# Altium project DAP.PrjPcb (part 3 of 3)

## Sheet DAP-MCU-3.SchDoc
size D; SheetNumber: 3; SheetTotal: 4
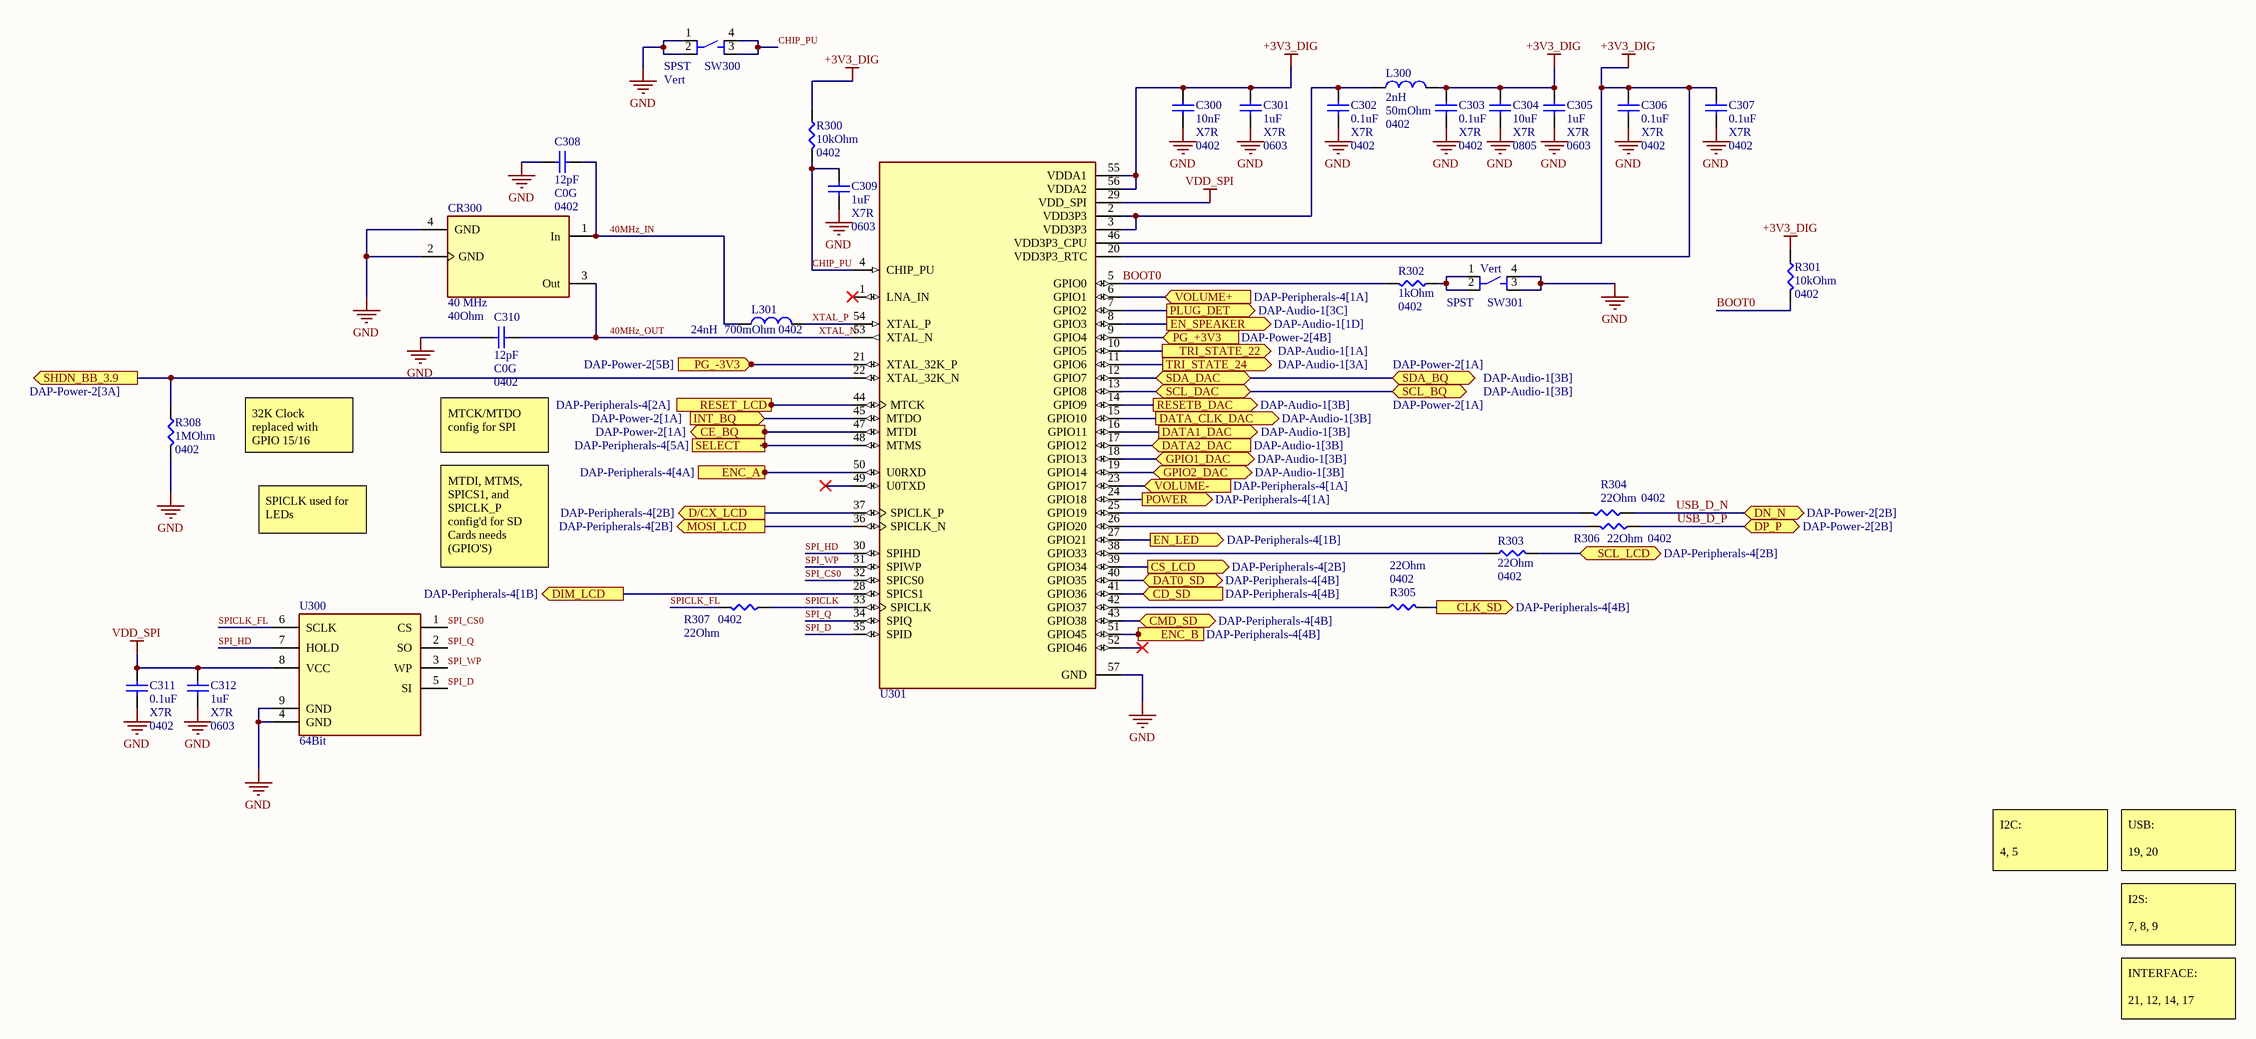
[diagram p2: DAP-MCU-3.SchDoc]

### Parts
C300  <Value>: 10nF  <Spec>: X7R  <Footprint>: 0402  [CAPC1005X55N]  (hidden comment: CAP CER 10000PF 16V X7R 0402)
C301  <Value>: 1uF  <Spec>: X7R  <Footprint>: 0603  [CAPC1608X100N]  (hidden comment: CAP CER 1UF 25V X7R 0603)
C302  <Value>: 0.1uF  <Spec>: X7R  <Footprint>: 0402  [CAPC1005X60N]  (hidden comment: CAP CER 0.1UF 50V X7R 0402)
C303  <Value>: 0.1uF  <Spec>: X7R  <Footprint>: 0402  [CAPC1005X60N]  (hidden comment: CAP CER 0.1UF 50V X7R 0402)
C304  <Value>: 10uF  <Spec>: X7R  <Footprint>: 0805  [CAPC2012X140N]  (hidden comment: CAP CER 10UF 10V X7R 0805)
C305  <Value>: 1uF  <Spec>: X7R  <Footprint>: 0603  [CAPC1608X100N]  (hidden comment: CAP CER 1UF 25V X7R 0603)
C306  <Value>: 0.1uF  <Spec>: X7R  <Footprint>: 0402  [CAPC1005X60N]  (hidden comment: CAP CER 0.1UF 50V X7R 0402)
C307  <Value>: 0.1uF  <Spec>: X7R  <Footprint>: 0402  [CAPC1005X60N]  (hidden comment: CAP CER 0.1UF 50V X7R 0402)
C308  <Value>: 12pF  <Spec>: C0G  <Footprint>: 0402  [CAPC1005X60N]  (hidden comment: CAP CER 12PF 50V C0G/NP0 0402)
C309  <Value>: 1uF  <Spec>: X7R  <Footprint>: 0603  [CAPC1608X100N]  (hidden comment: CAP CER 1UF 25V X7R 0603)
C310  <Value>: 12pF  <Spec>: C0G  <Footprint>: 0402  [CAPC1005X60N]  (hidden comment: CAP CER 12PF 50V C0G/NP0 0402)
C311  <Value>: 0.1uF  <Spec>: X7R  <Footprint>: 0402  [CAPC1005X60N]  (hidden comment: CAP CER 0.1UF 50V X7R 0402)
C312  <Value>: 1uF  <Spec>: X7R  <Footprint>: 0603  [CAPC1608X100N]  (hidden comment: CAP CER 1UF 25V X7R 0603)
CR300  <Value>: 40 MHz  <Spec>: 40Ohm  [CRYST_ECS-400]  (hidden comment: CRYSTAL 40.0000MHZ 10PF SMD)
L300  <Value>: 2nH  <Spec>: 50mOhm  <Footprint>: 0402  [IND_MHQ100507]  (hidden comment: FIXED IND 2NH 1A 50 MOHM SMD)
L301  <Value>: 24nH  <Spec>: 700mOhm  <Footprint>: 0402  [IND_MHQ100507]  (hidden comment: FIXED IND 24NH 250MA 700 MOHM)
R300  <Value>: 10kOhm  <Footprint>: 0402  [RESC1005X40N]  (hidden comment: RES SMD 10K OHM 1% 1/16W 0402)
R301  <Value>: 10kOhm  <Footprint>: 0402  [RESC1005X40N]  (hidden comment: RES SMD 10K OHM 1% 1/16W 0402)
R302  <Value>: 1kOhm  <Footprint>: 0402  [RESC1005X40N]  (hidden comment: RES SMD 1K OHM 0.1% 1/16W 0402)
R303  <Value>: 22Ohm  <Footprint>: 0402  [RESC1005X40N]  (hidden comment: RES 22 OHM 1% 1/16W 0402)
R304  <Value>: 22Ohm  <Footprint>: 0402  [RESC1005X40N]  (hidden comment: RES 22 OHM 1% 1/16W 0402)
R305  <Value>: 22Ohm  <Footprint>: 0402  [RESC1005X40N]  (hidden comment: RES 22 OHM 1% 1/16W 0402)
R306  <Value>: 22Ohm  <Footprint>: 0402  [RESC1005X40N]  (hidden comment: RES 22 OHM 1% 1/16W 0402)
R307  <Value>: 22Ohm  <Footprint>: 0402  [RESC1005X40N]  (hidden comment: RES 22 OHM 1% 1/16W 0402)
R308  <Value>: 1MOhm  <Footprint>: 0402  [RESC1005X40N]  (hidden comment: RES SMD 1M OHM 0.1% 1/16W 0402)
SW300  <Value>: SPST  <Footprint>: Vert  [SW_PTS810_SJM_250_SMTR_LFS]  (hidden comment: SWITCH TACTILE SPST-NO 0.05A 16V)
SW301  <Value>: SPST  <Footprint>: Vert  [SW_PTS810_SJM_250_SMTR_LFS]  (hidden comment: SWITCH TACTILE SPST-NO 0.05A 16V)
U300  <Value>: 64Bit  [SON127P600X500X80-9N]  (hidden comment: IC FLASH 64MBIT SPI/QUAD 8WSON)
U301  ESP32-S3  [IC_ESP32-S3]  (value not drawn)

### Ports
CD_SD (in, see DAP-Peripherals-4[4B]), CE_BQ (out, see DAP-Power-2[1A]), CLK_SD (out, see DAP-Peripherals-4[4B]), CMD_SD (bidir, see DAP-Peripherals-4[4B]), CS_LCD (out, see DAP-Peripherals-4[2B]), D/CX_LCD (out, see DAP-Peripherals-4[2B]), DAT0_SD (bidir, see DAP-Peripherals-4[4B]), DATA1_DAC (out, see DAP-Audio-1[3B]), DATA2_DAC (in, see DAP-Audio-1[3B]), DATA_CLK_DAC (out, see DAP-Audio-1[3B]), DIM_LCD (out, see DAP-Peripherals-4[1B]), DN_N (bidir, see DAP-Power-2[2B]), DP_P (bidir, see DAP-Power-2[2B]), EN_LED (out, see DAP-Peripherals-4[1B]), EN_SPEAKER (out, see DAP-Audio-1[1D]), ENC_A (in, see DAP-Peripherals-4[4A]), ENC_B (in, see DAP-Peripherals-4[4B]), GPIO1_DAC (bidir, see DAP-Audio-1[3B]), GPIO2_DAC (bidir, see DAP-Audio-1[3B]), INT_BQ (in, see DAP-Power-2[1A]), MOSI_LCD (out, see DAP-Peripherals-4[2B]), PG_+3V3 (in, see DAP-Power-2[4B]), PG_-3V3 (in, see DAP-Power-2[5B]), PLUG_DET (out, see DAP-Audio-1[3C]), POWER (out, see DAP-Peripherals-4[1A]), RESET_LCD (out, see DAP-Peripherals-4[2A]), RESETB_DAC (out, see DAP-Audio-1[3B]), SCL_BQ (bidir, see DAP-Power-2[1A]), SCL_DAC (bidir, see DAP-Audio-1[3B]), SCL_LCD (bidir, see DAP-Peripherals-4[2B]), SDA_BQ (bidir, see DAP-Power-2[1A]), SDA_DAC (bidir, see DAP-Audio-1[3B]), SELECT (in, see DAP-Peripherals-4[5A]), SHDN_BB_3.9 (out, see DAP-Power-2[3A]), TRI_STATE_22 (out, see DAP-Audio-1[1A]), TRI_STATE_24 (out, see DAP-Audio-1[3A]), VOLUME+ (in, see DAP-Peripherals-4[1A]), VOLUME- (in, see DAP-Peripherals-4[1A])

### Nets
+3V3_DIG: C300.2 C301.2 C303.2 C304.2 C305.2 C306.2 C307.2 L300.2 R300.2 R301.2 U301.20(VDD3P3_RTC) U301.46(VDD3P3_CPU) U301.55(VDDA1) U301.56(VDDA2)
GND: C300.1 C301.1 C302.1 C303.1 C304.1 C305.1 C306.1 C307.1 C308.2 C309.1 C310.2 C311.1 C312.1 CR300.2(GND) CR300.4(GND) R308.1 SW300.1 SW300.2 SW301.3 SW301.4 U300.4(GND) U300.9(GND) U301.57(GND)
VDD_SPI: C311.2 C312.2 U300.8(VCC) U301.29(VDD_SPI)
40MHz_IN: C308.1 CR300.1(In) L301.1
40MHz_OUT: C310.1 CR300.3(Out) U301.53(XTAL_N)  [also labelled XTAL_N]
BOOT0: R301.1 R302.1 U301.5(GPIO0)
CD_SD: U301.41(GPIO36) ; port CD_SD
CE_BQ: U301.47(MTDI) ; port CE_BQ
CHIP_PU: C309.2 R300.1 SW300.3 SW300.4 U301.4(CHIP_PU)
CLK_SD: R305.1 ; port CLK_SD
CMD_SD: U301.43(GPIO38) ; port CMD_SD
CS_LCD: U301.39(GPIO34) ; port CS_LCD
D/CX_LCD: U301.37(SPICLK_P) ; port D/CX_LCD
DAT0_SD: U301.40(GPIO35) ; port DAT0_SD
DATA1_DAC: U301.16(GPIO11) ; port DATA1_DAC
DATA2_DAC: U301.17(GPIO12) ; port DATA2_DAC
DATA_CLK_DAC: U301.15(GPIO10) ; port DATA_CLK_DAC
GPIO1_DAC: U301.18(GPIO13) ; port GPIO1_DAC
GPIO2_DAC: U301.19(GPIO14) ; port GPIO2_DAC
INT_BQ: U301.45(MTDO) ; port INT_BQ
MOSI_LCD: U301.36(SPICLK_N) ; port MOSI_LCD
PG_LDO-: U301.21(XTAL_32K_P) ; port PG_-3V3
POWER: U301.24(GPIO18) ; port POWER
RESET: U301.44(MTCK) ; port RESET_LCD
RESETB_DAC: U301.14(GPIO9) ; port RESETB_DAC
SCL_BQ: U301.13(GPIO8) ; port SCL_DAC, port SCL_BQ
SCL_LCD: R303.1 ; port SCL_LCD
SDA_BQ: U301.12(GPIO7) ; port SDA_DAC, port SDA_BQ
SELECT: U301.48(MTMS) ; port SELECT
SPI_CS0: U300.1(CS) U301.32(SPICS0)
SPI_D: U300.5(SI) U301.35(SPID)
SPI_HD: U300.7(HOLD) U301.30(SPIHD)
SPI_Q: U300.2(SO) U301.34(SPIQ)
SPI_WP: U300.3(WP) U301.31(SPIWP)
SPICLK: R307.2 U301.33(SPICLK)
SPICLK_FL: R307.1 U300.6(SCLK)
TRI_STATE_22: U301.10(GPIO5) ; port TRI_STATE_22
TRI_STATE_24: U301.11(GPIO6) ; port TRI_STATE_24
USB_D_N: R304.2 ; port DN_N
USB_D_P: R306.2 ; port DP_P
VOLUME+: U301.6(GPIO1) ; port VOLUME+
VOLUME-: U301.23(GPIO17) ; port VOLUME-
XTAL_P: L301.2 U301.54(XTAL_P)
NetC302_2: C302.2 L300.1 U301.2(VDD3P3) U301.3(VDD3P3)
NetC404_2: U301.50(U0RXD) ; port ENC_A
NetC405_2: U301.51(GPIO45) ; port ENC_B
NetQ400_1: U301.28(SPICS1) ; port DIM_LCD
NetR119_1: U301.7(GPIO2) ; port PLUG_DET
NetR128_1: U301.8(GPIO3) ; port EN_SPEAKER
NetR203_1: R308.2 U301.22(XTAL_32K_N) ; port SHDN_BB_3.9
NetR223_1: U301.9(GPIO4) ; port PG_+3V3
NetR302_2: R302.2 SW301.1 SW301.2
NetR303_2: R303.2 U301.38(GPIO33)
NetR304_1: R304.1 U301.25(GPIO19)
NetR305_2: R305.2 U301.42(GPIO37)
NetR306_1: R306.1 U301.26(GPIO20)
NetU301_27: U301.27(GPIO21) ; port EN_LED

Not connected (* = marked no-connect by the designer): U301 1(LNA_IN)* 49(U0TXD)* 52(GPIO46)*

### Notes on the sheet
- 32K Clock replaced with GPIO 15/16
- MTCK/MTDO config for SPI
- SPICLK used for LEDs
- MTDI, MTMS, SPICS1, and SPICLK_P config'd for SD Cards needs (GPIO'S)
- I2C:
  4, 5
- USB:
  19, 20
- I2S:
  7, 8, 9
- INTERFACE:
  21, 12, 14, 17

### Library data of the parts
C300 = #1-040: Manufacturer 1: YAGEO; Manufacturer Part Number 1: CC0402KRX7R7BB103; AL-PN: #1-040; SubType: Ceramic; <Tolerance>: 0.1; <Termination>: SMD; Creator Project: aRTy; Type: Standard; Lead Time: 21 Weeks; PartType: Capacitor; <Rating>: 16V; Status: Verified; Supplier 1: Digikey; Supplier Label: 10000 pF ±10% 16V Ceramic Capacitor X7R 0402 (1005 Metric); Supplier Part Number 1: 311-1042-2-ND
C301 C305 C309 C312 = #1-132: Manufacturer 1: Murata Electronics; Manufacturer Part Number 1: GCM188R71E105KA64D; AL-PN: #1-132; SubType: Ceramic; <Tolerance>: 0.1; <Termination>: SMD; Creator Project: DAP; Type: Standard; Lead Time: 21 Weeks; PartType: Capacitor; <Rating>: 25V; Status: Verified; Supplier 1: Digikey; Supplier Label: 1 µF ±10% 25V Ceramic Capacitor X7R 0603 (1608 Metric); Supplier Part Number 1: 490-10673-1-ND
C302 C303 C306 C307 C311 = #1-080: Manufacturer 1: Murata Electronics; Manufacturer Part Number 1: GCM155R71H104KE02D; AL-PN: #1-080; SubType: Ceramic; <Tolerance>: 0.1; <Termination>: SMD; Creator Project: DAP; Type: Standard; Lead Time: 21 Weeks; PartType: Capacitor; <Rating>: 50V; Status: Verified; Supplier 1: Digikey; Supplier Label: 0.1 µF ±10% 50V Ceramic Capacitor X7R 0402 (1005 Metric); Supplier Part Number 1: 490-10672-1-ND
C304 = #1-081: Manufacturer 1: Murata Electronics; Manufacturer Part Number 1: GCM21BR71A106KE22K; AL-PN: #1-081; SubType: Ceramic; <Tolerance>: 0.1; <Termination>: SMD; Creator Project: DAP; Type: Standard; Lead Time: 21 Weeks; PartType: Capacitor; <Rating>: 10V; Status: Verified; Supplier 1: Digikey; Supplier Label: 10 µF ±10% 10V Ceramic Capacitor X7R 0805 (2012 Metric); Supplier Part Number 1: 490-14531-1-ND
C308 C310 = #1-122: Manufacturer 1: Murata Electronics; Manufacturer Part Number 1: GJM1555C1H120FB01D; AL-PN: #1-122; SubType: Ceramic; <Tolerance>: 0.01; <Termination>: SMD; Creator Project: DAP; Type: Standard; Lead Time: 17 Weeks; PartType: Capacitor; <Rating>: 50V; Status: Verified; Supplier 1: Digikey; Supplier Label: 12 pF ±1% 50V Ceramic Capacitor C0G, NP0 0402 (1005 Metric); Supplier Part Number 1: 490-11190-1-ND
CR300 = #1-118: Manufacturer 1: ECS Inc.; Manufacturer Part Number 1: ECS-400-10-37B2-CKY-TR; AL-PN: #1-118; Creator Project: DAP; Type: Standard; PartType: Crystal; <Rating>: 10pF; <Termination>: SMD; Status: Verified; Supplier 1: Digikey; Supplier Label: 40 MHz ±10ppm Crystal 12pF 40 Ohms 4-SMD, No Lead; Supplier Part Number 1: 50-ECS-400-10-37B2-CKY-TRCT-ND; Lead Time: N/A
L300 = #1-121: Manufacturer 1: TDK; Manufacturer Part Number 1: MHQ1005075HA2N0BTD25; AL-PN: #1-121; SubType: Shielded; Creator Project: DAP; Type: Standard; Lead Time: 12 Weeks; PartType: Inductor; <Rating>: 1A; <Termination>: SMD; Status: Verified; Supplier 1: Digikey; Supplier Label: 2 nH Shielded Multilayer Inductor 1 A 50mOhm Max 0402 (1005 Metric); Supplier Part Number 1: 445-MHQ1005075HA2N0BTD25CT-ND
L301 = #1-120: Manufacturer 1: TDK; Manufacturer Part Number 1: MHQ1005075HA24NHTD25; AL-PN: #1-120; SubType: Shielded; <Tolerance>: 0.03; <Termination>: SMD; Creator Project: DAP; Type: Standard; Lead Time: 12 Weeks; PartType: Inductor; <Rating>: 250mA; Status: Verified; Supplier 1: Digikey; Supplier Label: 24 nH Shielded Multilayer Inductor 250 mA 700mOhm Max 0402 (1005 Metric); Supplier Part Number 1: 445-MHQ1005075HA24NHTD25CT-ND
R300 R301 = #1-134: Manufacturer 1: YAGEO; Manufacturer Part Number 1: AC0402FR-0710KL; AL-PN: #1-134; <Tolerance>: 0.01; Creator Project: DAP; Lead Time: 22 Weeks; PartType: Resistor; <Termination>: SMD; Status: Verified; Supplier 1: Digikey; Supplier Label: 10 kOhms ±1% 0.063W, 1/16W Chip Resistor 0402 (1005 Metric) Automotive AEC-Q200, Moisture Resistant Thick Film; Supplier Part Number 1: YAG3436CT-ND; Type: Standard
R302 = #1-043: Manufacturer 1: YAGEO; Manufacturer Part Number 1: RT0402BRD071KL; AL-PN: #1-043; <Tolerance>: 0.001; Creator Project: aRTy; Lead Time: 20 Weeks; PartType: Resistor; <Rating>: 1/16W; <Termination>: SMD; Status: Verified; Supplier 1: Digikey; Supplier Label: 1 kOhms ±0.1% 0.063W, 1/16W Chip Resistor 0402 (1005 Metric) Thin Film; Supplier Part Number 1: YAG1386TR-ND; Type: Standard
R303-R307 = #1-102: Manufacturer 1: YAGEO; Manufacturer Part Number 1: RC0402FR-0722RL; AL-PN: #1-102; <Tolerance>: 0.01; <Termination>: SMD; Creator Project: DAP; Lead Time: 22 Weeks; PartType: Resistor; <Rating>: 1/16W; Status: Verified; Supplier 1: Digikey; Supplier Label: 22 Ohms ±1% 0.063W, 1/16W Chip Resistor 0402 (1005 Metric) Moisture Resistant Thick Film; Supplier Part Number 1: 311-22.0LRCT-ND; Type: Standard
R308 = #1-123: Manufacturer 1: YAGEO; Manufacturer Part Number 1: RE0402BRE071ML; AL-PN: #1-123; <Tolerance>: 0.001; Creator Project: DAP; Lead Time: 20 Weeks; PartType: Resistor; <Rating>: 1/16W; <Termination>: SMD; Status: Verified; Supplier 1: Digikey; Supplier Label: 1 MOhms ±0.1% 0.063W, 1/16W Chip Resistor 0402 (1005 Metric) Thick Film; Supplier Part Number 1: 13-RE0402BRE071MLCT-ND; Type: Standard
SW300 SW301 = #1-115: Manufacturer Part Number 1: PTS810SJM250SMTR LFS; MF: C&K; MP: PTS810 SJM 250 SMTR LFS; AL-PN: #1-115; SubType: Tacticle; <Termination>: SMD; Creator Project: DAP; Lead Time: 16 Weeks; SnapEDA_Link: https://www.snapeda.com/parts/PTS810%20SJM%20250%20SMTR%20LFS/C%2526K/view-part/?ref=snap; Package: None; Value: *; Check_prices: https://www.snapeda.com/parts/PTS810%20SJM%20250%20SMTR%20LFS/C%2526K/view-part/?ref=eda; PartType: Switch; Status: Verified; Supplier 1: Digikey; Supplier Label: Tactile Switch SPST-NO Top Actuated Surface Mount; Supplier Part Number 1: CKN10502CT-ND; Type: Standard; Manufacturer 1: C&K
U300 = #1-124: Manufacturer 1: Gigadevice Electronics Singapore PTE.LTD.; Manufacturer Part Number 1: GD25B64EWIGR; AL-PN: #1-124; <Rating>: 133MHz; <Termination>: SMD; Creator Project: DAP; PartType: IC; SubType: FLASH; Status: Verified; Supplier 1: Digikey; Supplier Label: FLASH - NOR (SLC) Memory IC 64Mbit SPI - Quad I/O 133 MHz 7 ns 8-WSON (5x6); Supplier Part Number 1: 1970-GD25B64EWIGRCT-ND; Type: Standard; Lead Time: N/A
U301 = #1-055: Manufacturer 1: Espressif Technologies; MF: Espressif Systems; AL-PN: #1-055; SubType: ESP-32; <Termination>: SMD; Creator Project: DAP; Lead Time: 8 Weeks; Check_prices: https://www.snapeda.com/parts/ESP32-S3/Espressif+Systems/view-part/?ref=eda; Purchase-URL: https://pricing.snapeda.com/search/part/ESP32-S3/?ref=eda; Value: *; Availability: In Stock; Package: None; SnapEDA_Link: https://www.snapeda.com/parts/ESP32-S3/Espressif+Systems/view-part/?ref=snap; MP: ESP32-S3; Price: None; PartType: MCU; Status: Verified; Supplier 1: Digikey; Supplier Label: IC RF TxRx + MCU Bluetooth, WiFi 802.11b/g/n, Bluetooth v5.0 2.412GHz ~ 2.484GHz 56-VFQFN Exposed Pad; Supplier Part Number 1: 1965-ESP32-S3-ND; Type: Standard; Manufacturer Part Number 1: ESP32-S3

## Sheet DAP-Peripherals-4.SchDoc
size C; SheetNumber: 4; SheetTotal: 4
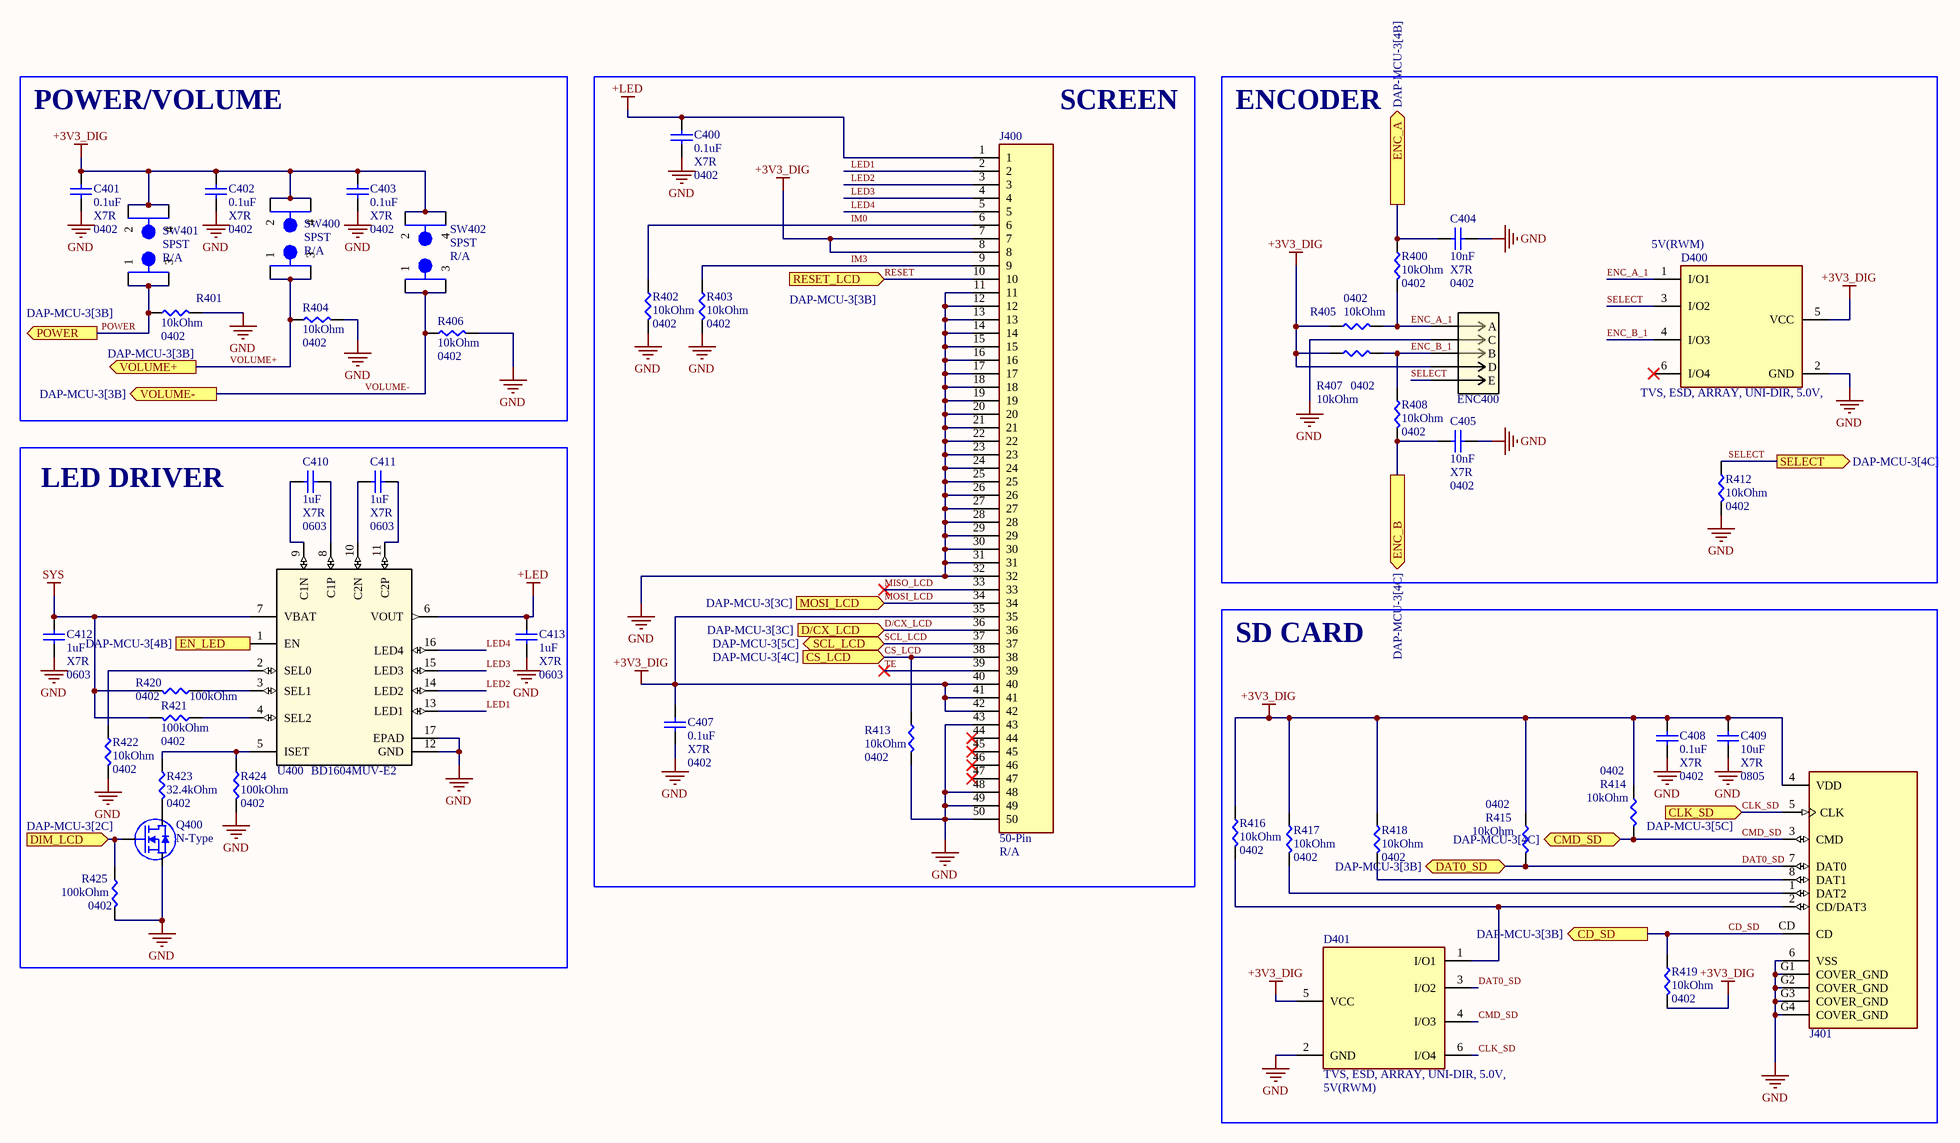
[diagram p3: DAP-Peripherals-4.SchDoc]

### Parts
C400  <Value>: 0.1uF  <Spec>: X7R  <Footprint>: 0402  [CAPC1005X60N]  (hidden comment: CAP CER 0.1UF 50V X7R 0402)
C401  <Value>: 0.1uF  <Spec>: X7R  <Footprint>: 0402  [CAPC1005X60N]  (hidden comment: CAP CER 0.1UF 50V X7R 0402)
C402  <Value>: 0.1uF  <Spec>: X7R  <Footprint>: 0402  [CAPC1005X60N]  (hidden comment: CAP CER 0.1UF 50V X7R 0402)
C403  <Value>: 0.1uF  <Spec>: X7R  <Footprint>: 0402  [CAPC1005X60N]  (hidden comment: CAP CER 0.1UF 50V X7R 0402)
C404  <Value>: 10nF  <Spec>: X7R  <Footprint>: 0402  [CAPC1005X55N]  (hidden comment: CAP CER 10000PF 16V X7R 0402)
C405  <Value>: 10nF  <Spec>: X7R  <Footprint>: 0402  [CAPC1005X55N]  (hidden comment: CAP CER 10000PF 16V X7R 0402)
C407  <Value>: 0.1uF  <Spec>: X7R  <Footprint>: 0402  [CAPC1005X60N]  (hidden comment: CAP CER 0.1UF 50V X7R 0402)
C408  <Value>: 0.1uF  <Spec>: X7R  <Footprint>: 0402  [CAPC1005X60N]  (hidden comment: CAP CER 0.1UF 50V X7R 0402)
C409  <Value>: 10uF  <Spec>: X7R  <Footprint>: 0805  [CAPC2012X140N]  (hidden comment: CAP CER 10UF 10V X7R 0805)
C410  <Value>: 1uF  <Spec>: X7R  <Footprint>: 0603  [CAPC1608X100N]  (hidden comment: CAP CER 1UF 25V X7R 0603)
C411  <Value>: 1uF  <Spec>: X7R  <Footprint>: 0603  [CAPC1608X100N]  (hidden comment: CAP CER 1UF 25V X7R 0603)
C412  <Value>: 1uF  <Spec>: X7R  <Footprint>: 0603  [CAPC1608X100N]  (hidden comment: CAP CER 1UF 25V X7R 0603)
C413  <Value>: 1uF  <Spec>: X7R  <Footprint>: 0603  [CAPC1608X100N]  (hidden comment: CAP CER 1UF 25V X7R 0603)
D400  TVS, ESD, ARRAY, UNI-DIR, 5.0V,  <Value>: 5V(RWM)  [TVS_ARR_4UNI_FP]
D401  TVS, ESD, ARRAY, UNI-DIR, 5.0V,  <Value>: 5V(RWM)  [TVS_ARR_4UNI_FP]
ENC400  ENCODER MECH QUAD RGH ANG PC PIN  [EN12-VS_TTE]  (value not drawn)
J400  <Value>: 50-Pin  <Footprint>: R/A  [AMPHENOL_F32D-1A7Y1-21050]  (hidden comment: CONN FFC BOTTOM 50POS 0.5MM R/A)
J401  CONN MICROSD CARD R/A SMD  [CUI_MSD-1-A]  (value not drawn)
Q400  <Value>: N-Type  [SOT-23_MCC]  (hidden comment: MOSFET N-CH 60V 115MA SOT23)
R400  <Value>: 10kOhm  <Footprint>: 0402  [RESC1005X40N]  (hidden comment: RES SMD 10K OHM 1% 1/16W 0402)
R401  <Value>: 10kOhm  <Footprint>: 0402  [RESC1005X40N]  (hidden comment: RES SMD 10K OHM 1% 1/16W 0402)
R402  <Value>: 10kOhm  <Footprint>: 0402  [RESC1005X40N]  (hidden comment: RES SMD 10K OHM 1% 1/16W 0402)
R403  <Value>: 10kOhm  <Footprint>: 0402  [RESC1005X40N]  (hidden comment: RES SMD 10K OHM 1% 1/16W 0402)
R404  <Value>: 10kOhm  <Footprint>: 0402  [RESC1005X40N]  (hidden comment: RES SMD 10K OHM 1% 1/16W 0402)
R405  <Value>: 10kOhm  <Footprint>: 0402  [RESC1005X40N]  (hidden comment: RES SMD 10K OHM 1% 1/16W 0402)
R406  <Value>: 10kOhm  <Footprint>: 0402  [RESC1005X40N]  (hidden comment: RES SMD 10K OHM 1% 1/16W 0402)
R407  <Value>: 10kOhm  <Footprint>: 0402  [RESC1005X40N]  (hidden comment: RES SMD 10K OHM 1% 1/16W 0402)
R408  <Value>: 10kOhm  <Footprint>: 0402  [RESC1005X40N]  (hidden comment: RES SMD 10K OHM 1% 1/16W 0402)
R412  <Value>: 10kOhm  <Footprint>: 0402  [RESC1005X40N]  (hidden comment: RES SMD 10K OHM 1% 1/16W 0402)
R413  <Value>: 10kOhm  <Footprint>: 0402  [RESC1005X40N]  (hidden comment: RES SMD 10K OHM 1% 1/16W 0402)
R414  <Value>: 10kOhm  <Footprint>: 0402  [RESC1005X40N]  (hidden comment: RES SMD 10K OHM 1% 1/16W 0402)
R415  <Value>: 10kOhm  <Footprint>: 0402  [RESC1005X40N]  (hidden comment: RES SMD 10K OHM 1% 1/16W 0402)
R416  <Value>: 10kOhm  <Footprint>: 0402  [RESC1005X40N]  (hidden comment: RES SMD 10K OHM 1% 1/16W 0402)
R417  <Value>: 10kOhm  <Footprint>: 0402  [RESC1005X40N]  (hidden comment: RES SMD 10K OHM 1% 1/16W 0402)
R418  <Value>: 10kOhm  <Footprint>: 0402  [RESC1005X40N]  (hidden comment: RES SMD 10K OHM 1% 1/16W 0402)
R419  <Value>: 10kOhm  <Footprint>: 0402  [RESC1005X40N]  (hidden comment: RES SMD 10K OHM 1% 1/16W 0402)
R420  <Value>: 100kOhm  <Footprint>: 0402  [RESC1005X40N]  (hidden comment: RES SMD 100K OHM 0.1% 1/16W 0402)
R421  <Value>: 100kOhm  <Footprint>: 0402  [RESC1005X40N]  (hidden comment: RES SMD 100K OHM 0.1% 1/16W 0402)
R422  <Value>: 10kOhm  <Footprint>: 0402  [RESC1005X40N]  (hidden comment: RES SMD 10K OHM 1% 1/16W 0402)
R423  <Value>: 32.4kOhm  <Footprint>: 0402  [RESC1005X40N]  (hidden comment: RES 32.4K OHM 1% 1/16W 0402)
R424  <Value>: 100kOhm  <Footprint>: 0402  [RESC1005X40N]  (hidden comment: RES SMD 100K OHM 0.1% 1/16W 0402)
R425  <Value>: 100kOhm  <Footprint>: 0402  [RESC1005X40N]  (hidden comment: RES SMD 100K OHM 0.1% 1/16W 0402)
SW400  <Value>: SPST  <Footprint>: R/A  [SW_TL1014BF220QG]  (hidden comment: SWITCH TACTILE SPST-NO 0.05A 12V)
SW401  <Value>: SPST  <Footprint>: R/A  [SW_TL1014BF220QG]  (hidden comment: SWITCH TACTILE SPST-NO 0.05A 12V)
SW402  <Value>: SPST  <Footprint>: R/A  [SW_TL1014BF220QG]  (hidden comment: SWITCH TACTILE SPST-NO 0.05A 12V)
U400  IC LED DRIVER RGLTR 30MA 16VQFN  [VQFN016V3030_ROM]  (value not drawn)

### Blocks framed on the sheet
POWER/VOLUME: C401-C403 R401 R404 R406 SW400-SW402
SCREEN: C400 C407 J400 R402 R403 R413
ENCODER: C404 C405 D400 ENC400 R400 R405 R407 R408 R412
LED DRIVER: C410-C413 Q400 R420-R425 U400
SD CARD: C408 C409 D401 J401 R414-R419

### Ports
CD_SD (out, see DAP-MCU-3[3B]), CLK_SD (in, see DAP-MCU-3[5C]), CMD_SD (bidir, see DAP-MCU-3[4C]), CS_LCD (in, see DAP-MCU-3[4C]), D/CX_LCD (in, see DAP-MCU-3[3C]), DAT0_SD (bidir, see DAP-MCU-3[3B]), DIM_LCD (in, see DAP-MCU-3[2C]), EN_LED (in, see DAP-MCU-3[4B]), ENC_A (out, see DAP-MCU-3[4B]), ENC_B (out, see DAP-MCU-3[4C]), MOSI_LCD (in, see DAP-MCU-3[3C]), POWER (out, see DAP-MCU-3[3B]), RESET_LCD (in, see DAP-MCU-3[3B]), SCL_LCD (bidir, see DAP-MCU-3[5C]), SELECT (out, see DAP-MCU-3[4C]), VOLUME+ (out, see DAP-MCU-3[3B]), VOLUME- (out, see DAP-MCU-3[3B])

### Nets
+3V3_DIG: C401.2 C402.2 C403.2 C407.2 C408.2 C409.2 D400.5(VCC) D401.5(VCC) ENC400.4(D) J400.7 J400.8 J400.35 J400.40 J400.41 J400.42 J401.4(VDD) R405.2 R407.2 R414.2 R415.2 R416.2 R417.2 R418.2 R419.1 SW400.2 SW400.4 SW401.2 SW401.4 SW402.2 SW402.4
+LED: C400.2 C413.2 J400.1 U400.6(VOUT)
GND: C400.1 C401.1 C402.1 C403.1 C404.1 C405.1 C407.1 C408.1 C409.1 C412.1 C413.1 D400.2(GND) D401.2(GND) ENC400.2(C) J400.11 J400.12 J400.13 J400.14 J400.15 J400.16 J400.17 J400.18 J400.19 J400.20 J400.21 J400.22 J400.23 J400.24 J400.25 J400.26 J400.27 J400.28 J400.29 J400.30 J400.31 J400.32 J400.43 J400.48 J400.49 J400.50 J401.6(VSS) J401.G1(COVER_GND) J401.G2(COVER_GND) J401.G3(COVER_GND) J401.G4(COVER_GND) Q400.2(S) R401.1 R402.1 R403.1 R404.1 R406.1 R412.1 R413.1 R422.1 R424.1 R425.1 U400.12(GND) U400.17(EPAD)
SYS: C412.2 R420.1 R421.1 U400.7(VBAT)
CD_SD: J401.CD R419.2 ; port CD_SD
CLK_SD: D401.6(I/O4) J401.5(CLK) ; port CLK_SD
CMD_SD: D401.4(I/O3) J401.3(CMD) R414.1 ; port CMD_SD
CS_LCD: J400.38 R413.2 ; port CS_LCD
D/CX_LCD: J400.36 ; port D/CX_LCD
DAT0_SD: D401.3(I/O2) J401.7(DAT0) R415.1 ; port DAT0_SD
ENC_A_1: D400.1(I/O1) ENC400.1(A) R400.1 R405.1
ENC_B_1: D400.4(I/O3) ENC400.3(B) R407.1 R408.2
IM0: J400.6 R402.2
IM3: J400.9 R403.2
LED1: J400.2 U400.13(LED1)
LED2: J400.3 U400.14(LED2)
LED3: J400.4 U400.15(LED3)
LED4: J400.5 U400.16(LED4)
MISO_LCD: J400.33
MOSI_LCD: J400.34 ; port MOSI_LCD
POWER: R401.2 SW401.1 SW401.3 ; port POWER
RESET: J400.10 ; port RESET_LCD
SCL_LCD: J400.37 ; port SCL_LCD
SELECT: D400.3(I/O2) ENC400.5(E) R412.2 ; port SELECT
TE: J400.39
VOLUME+: R404.2 SW400.1 SW400.3 ; port VOLUME+
VOLUME-: R406.2 SW402.1 SW402.3 ; port VOLUME-
NetC404_2: C404.2 R400.2 ; port ENC_A
NetC405_2: C405.2 R408.1 ; port ENC_B
NetC410_1: C410.1 U400.8(C1P)
NetC410_2: C410.2 U400.9(C1N)
NetC411_1: C411.1 U400.11(C2P)
NetC411_2: C411.2 U400.10(C2N)
NetD401_1: D401.1(I/O1) J401.2(CD/DAT3) R416.1
NetJ401_1: J401.1(DAT2) R417.1
NetJ401_8: J401.8(DAT1) R418.1
NetQ400_1: Q400.1(G) R425.2 ; port DIM_LCD
NetQ400_3: Q400.3(D) R423.1
NetR420_2: R420.2 U400.3(SEL1)
NetR421_2: R421.2 U400.4(SEL2)
NetR422_2: R422.2 U400.2(SEL0)
NetR423_2: R423.2 R424.2 U400.5(ISET)
NetU301_27: U400.1(EN) ; port EN_LED

Not connected (* = marked no-connect by the designer): D400 6(I/O4)*; J400 44* 45* 46* 47*

### Library data of the parts
C400-C403 C407 C408 = #1-080: as C302 on sheet DAP-MCU-3; PartType: Capacitor; <Rating>: 50V; Status: Verified; Supplier 1: Digikey; Supplier Label: 0.1 µF ±10% 50V Ceramic Capacitor X7R 0402 (1005 Metric); Supplier Part Number 1: 490-10672-1-ND
C404 C405 = #1-040: as C300 on sheet DAP-MCU-3; PartType: Capacitor; <Rating>: 16V; Status: Verified; Supplier 1: Digikey; Supplier Label: 10000 pF ±10% 16V Ceramic Capacitor X7R 0402 (1005 Metric); Supplier Part Number 1: 311-1042-2-ND
C409 = #1-081: as C304 on sheet DAP-MCU-3; PartType: Capacitor; <Rating>: 10V; Status: Verified; Supplier 1: Digikey; Supplier Label: 10 µF ±10% 10V Ceramic Capacitor X7R 0805 (2012 Metric); Supplier Part Number 1: 490-14531-1-ND
C410-C413 = #1-132: as C301 on sheet DAP-MCU-3; PartType: Capacitor; <Rating>: 25V; Status: Verified; Supplier 1: Digikey; Supplier Label: 1 µF ±10% 25V Ceramic Capacitor X7R 0603 (1608 Metric); Supplier Part Number 1: 490-10673-1-ND
D400 D401 = #1-127: Manufacturer 1: Good-Ark Semiconductor; Manufacturer Part Number 1: GSER5U007; AL-PN: #1-127; <Rating>: 12A; <Termination>: SMD; Creator Project: DAP; Lead Time: 16 Weeks; Type: Standard; PartType: Diode; Status: Verified; SubType: TVS; Supplier 1: Digikey; Supplier Label: 25V Clamp 12A (8/20µs) Ipp Tvs Diode Surface Mount SOT-23-6L; Supplier Part Number 1: 4786-GSER5U007CT-ND
ENC400 = #1-135: Manufacturer 1: TT Electronics; Manufacturer Part Number 1: EN12-VS11AF18; AL-PN: #1-135; SubType: Quadrature; <Termination>: Thru; Creator Project: DAP; Lead Time: 34 Weeks; PartType: Encoder; Status: Verified; Supplier 1: Digikey; Supplier Label: Rotary Encoder Mechanical 12 Quadrature (Incremental) Right Angle; Supplier Part Number 1: 987-1198-ND; Type: Standard
J400 = #1-117: Manufacturer 1: Amphenol ICC; MF: Amphenol ICC (FCI); AL-PN: #1-117; <Termination>: SMD; Creator Project: DAP; Lead Time: 13 Weeks; SnapEDA_Link: https://www.snapeda.com/parts/F32D-1A7Y1-21050/Amphenol+FCI/view-part/?ref=snap; Package: None; Value: *; MP: F32D-1A7Y1-21050; Check_prices: https://www.snapeda.com/parts/F32D-1A7Y1-21050/Amphenol+FCI/view-part/?ref=eda; PartType: Connector; SubType: FFC; Status: Verified; Supplier 1: Digikey; Supplier Label: 50 Position FFC, FPC Connector Contacts, Top and Bottom 0.020" (0.50mm) Surface Mount, Right Angle; Supplier Part Number 1: 609-F32D-1A7Y1-21050CT-ND; Type: Standard; Manufacturer Part Number 1: F32D-1A7Y1-21050
J401 = #1-126: MF: Same Sky; AL-PN: #1-126; SubType: Micro-SD; Creator Project: DAP; Lead Time: 8 Weeks; SnapEDA_Link: https://www.snapeda.com/parts/MSD-1-A/Same+Sky/view-part/?ref=snap; Package: None; Value: *; MP: MSD-1-A; Check_prices: https://www.snapeda.com/parts/MSD-1-A/Same+Sky/view-part/?ref=eda; PartType: Connector; <Termination>: SMD; Status: Verified; Supplier 1: Digikey; Supplier Label: 9 (8 + 1) Position Card Connector microSD™ Surface Mount, Right Angle Gold; Supplier Part Number 1: 2223-MSD-1-ACT-ND; Type: Standard; Manufacturer 1: Same Sky; Manufacturer Part Number 1: MSD-1-A
Q400 = #1-130: Manufacturer 1: MCC; MF: Micro Commercial; MP: 2N7002-TP; AL-PN: #1-130; <Rating>: 2.5Vgs; <Termination>: SMD; Creator Project: DAP; Type: Standard; SnapEDA_Link: https://www.snapeda.com/parts/2N7002-TP/Micro+Commercial/view-part/?ref=snap; Package: TO-236 MCC; Value: *; Check_prices: https://www.snapeda.com/parts/2N7002-TP/Micro+Commercial/view-part/?ref=eda; PartType: Transistor; SubType: MOSFET; Status: Verified; Supplier 1: Digikey; Supplier Label: N-Channel 60 V 115mA (Ta) 1.08W Surface Mount SOT-23; Supplier Part Number 1: 2N7002-TPMSCT-ND; Manufacturer Part Number 1: 2N7002-TP; Lead Time: N/A
R400-R408 R412-R419 R422 = #1-134: as R300 on sheet DAP-MCU-3; PartType: Resistor; <Termination>: SMD; Status: Verified; Supplier 1: Digikey; Supplier Label: 10 kOhms ±1% 0.063W, 1/16W Chip Resistor 0402 (1005 Metric) Automotive AEC-Q200, Moisture Resistant Thick Film; Supplier Part Number 1: YAG3436CT-ND; Type: Standard
R420 R421 R424 R425 = #1-131: Manufacturer 1: YAGEO; Manufacturer Part Number 1: RT0402BRD07100KL; AL-PN: #1-131; <Tolerance>: 0.01; Creator Project: DAP; Lead Time: 23 Weeks; PartType: Resistor; <Termination>: SMD; Status: Verified; Supplier 1: Digikey; Supplier Label: 100 kOhms ±0.1% 0.063W, 1/16W Chip Resistor 0402 (1005 Metric) Thin Film; Supplier Part Number 1: YAG1343CT-ND; Type: Standard
R423 = #1-133: Manufacturer 1: YAGEO; Manufacturer Part Number 1: RC0402FR-0732K4L; AL-PN: #1-133; <Tolerance>: 0.01; <Termination>: SMD; Creator Project: DAP; Lead Time: 22 Weeks; PartType: Resistor; Status: Verified; Supplier 1: Digikey; Supplier Label: 32.4 kOhms ±1% 0.063W, 1/16W Chip Resistor 0402 (1005 Metric) Moisture Resistant Thick Film; Supplier Part Number 1: YAG3119CT-ND; Type: Standard
SW400-SW402 = #1-114: Manufacturer 1: E-Switch; Manufacturer Part Number 1: TL1014BF220QG; AL-PN: #1-114; SubType: Tacticle; <Termination>: SMD; Creator Project: DAP; Lead Time: 7 Weeks; PartType: Switch; Status: Verified; Supplier 1: Digikey; Supplier Label: Tactile Switch SPST-NO Side Actuated Surface Mount, Right Angle; Supplier Part Number 1: 141-TL1014BF220QGCT-ND; Type: Standard
U400 = #1-128: Manufacturer_Name: ROHM Semiconductor; AL-PN: #1-128; <Termination>: SMD; Creator Project: DAP; Lead Time: 12 Weeks; Copyright: Copyright (C) 2025 Ultra Librarian. All rights reserved.; Manufacturer_Part_Number: BD1604MUV-E2; RefDes: RefDes; Type: Standard; PartType: IC; SubType: LED Driver; Status: Verified; Supplier 1: Digikey; Supplier Label: LED Driver IC 4 Output DC DC Regulator Switched Capacitor (Charge Pump) Dimming 30mA VQFN016V3030; Supplier Part Number 1: BD1604MUV-E2CT-ND; Manufacturer 1: Rohm Semiconductor; Manufacturer Part Number 1: BD1604MUV-E2

## Nets that join several sheets
+3V3_ANALOG: DAP-Audio-1 (15 pins), DAP-Power-2 (5 pins)
+3V3_DAC: DAP-Audio-1 (12 pins), DAP-Power-2 (C231.2 R243.2 U206.9 U206.10)
+3V3_DIG: DAP-Audio-1 (B100.13 C121.2 C122.2 R118.2), DAP-Power-2 (14 pins), DAP-MCU-3 (14 pins), DAP-Peripherals-4 (30 pins)
-3V3: DAP-Audio-1 (13 pins), DAP-Power-2 (6 pins)
GND: DAP-Audio-1 (59 pins), DAP-Power-2 (86 pins), DAP-MCU-3 (23 pins), DAP-Peripherals-4 (58 pins)
SYS: DAP-Power-2 (12 pins), DAP-Peripherals-4 (C412.2 R420.1 R421.1 U400.7)
CD_SD: DAP-MCU-3 (U301.41), DAP-Peripherals-4 (J401.CD R419.2)
CE_BQ: DAP-Power-2 (R221.2 U202.1), DAP-MCU-3 (U301.47)
CLK_SD: DAP-MCU-3 (R305.1), DAP-Peripherals-4 (D401.6 J401.5)
CMD_SD: DAP-MCU-3 (U301.43), DAP-Peripherals-4 (D401.4 J401.3 R414.1)
CS_LCD: DAP-MCU-3 (U301.39), DAP-Peripherals-4 (J400.38 R413.2)
D/CX_LCD: DAP-MCU-3 (U301.37), DAP-Peripherals-4 (J400.36)
DAT0_SD: DAP-MCU-3 (U301.40), DAP-Peripherals-4 (D401.3 J401.7 R415.1)
DATA1_DAC: DAP-Audio-1 (B100.19), DAP-MCU-3 (U301.16)
DATA2_DAC: DAP-Audio-1 (B100.18), DAP-MCU-3 (U301.17)
DATA_CLK_DAC: DAP-Audio-1 (B100.20), DAP-MCU-3 (U301.15)
GPIO1_DAC: DAP-Audio-1 (B100.17 R112.2), DAP-MCU-3 (U301.18)
GPIO2_DAC: DAP-Audio-1 (B100.16 R113.2), DAP-MCU-3 (U301.19)
INT_BQ: DAP-Power-2 (R210.1 U202.8), DAP-MCU-3 (U301.45)
MOSI_LCD: DAP-MCU-3 (U301.36), DAP-Peripherals-4 (J400.34)
NetC404_2: DAP-MCU-3 (U301.50), DAP-Peripherals-4 (C404.2 R400.2)
NetC405_2: DAP-MCU-3 (U301.51), DAP-Peripherals-4 (C405.2 R408.1)
NetQ400_1: DAP-MCU-3 (U301.28), DAP-Peripherals-4 (Q400.1 R425.2)
NetR119_1: DAP-Audio-1 (R119.1), DAP-MCU-3 (U301.7)
NetR128_1: DAP-Audio-1 (R128.1), DAP-MCU-3 (U301.8)
NetR203_1: DAP-Power-2 (R203.1), DAP-MCU-3 (R308.2 U301.22)
NetR223_1: DAP-Power-2 (R223.1 U204.4), DAP-MCU-3 (U301.9)
NetU301_27: DAP-MCU-3 (U301.27), DAP-Peripherals-4 (U400.1)
PG_LDO-: DAP-Power-2 (R241.1 U203.4), DAP-MCU-3 (U301.21)
POWER: DAP-MCU-3 (U301.24), DAP-Peripherals-4 (R401.2 SW401.1 SW401.3)
RESET: DAP-MCU-3 (U301.44), DAP-Peripherals-4 (J400.10)
RESETB_DAC: DAP-Audio-1 (B100.21 R111.2), DAP-MCU-3 (U301.14)
SCL_BQ: DAP-Audio-1 (B100.23), DAP-Power-2 (R208.1 U202.6), DAP-MCU-3 (U301.13)
SCL_LCD: DAP-MCU-3 (R303.1), DAP-Peripherals-4 (J400.37)
SDA_BQ: DAP-Audio-1 (B100.24), DAP-Power-2 (R211.1 U202.5), DAP-MCU-3 (U301.12)
SELECT: DAP-MCU-3 (U301.48), DAP-Peripherals-4 (D400.3 ENC400.5 R412.2)
TRI_STATE_22: DAP-Audio-1 (R106.2 Y100.1), DAP-MCU-3 (U301.10)
TRI_STATE_24: DAP-Audio-1 (R107.2 Y101.1), DAP-MCU-3 (U301.11)
USB_D_N: DAP-Power-2 (D202.1 J201.A7 J201.B7), DAP-MCU-3 (R304.2)
USB_D_P: DAP-Power-2 (D202.2 J201.A6 J201.B6), DAP-MCU-3 (R306.2)
VOLUME+: DAP-MCU-3 (U301.6), DAP-Peripherals-4 (R404.2 SW400.1 SW400.3)
VOLUME-: DAP-MCU-3 (U301.23), DAP-Peripherals-4 (R406.2 SW402.1 SW402.3)